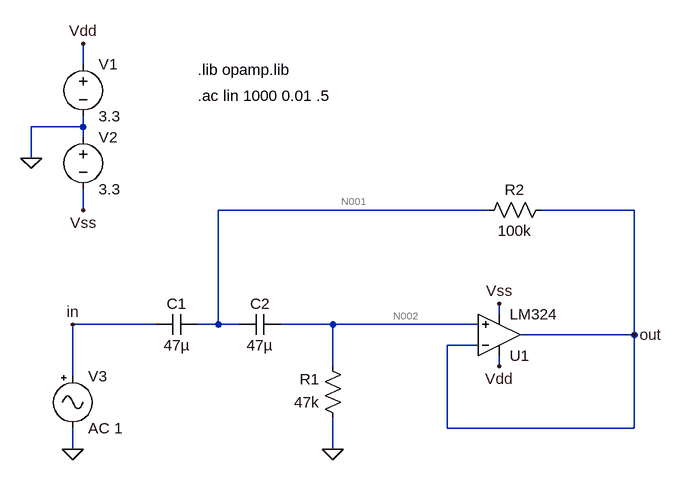
[diagram p0: schematic passa_altas_vcvs_2_ordem.asc]
passa_altas_vcvs_2_ordem.asc, the LTspice schematic file:
Version 4
SHEET 1 880 680
WIRE -352 -240 -352 -272
WIRE -352 -144 -352 -160
WIRE -352 -144 -432 -144
WIRE -352 -128 -352 -144
WIRE -432 -96 -432 -144
WIRE -352 -16 -352 -48
WIRE 272 -16 -144 -16
WIRE 496 -16 352 -16
WIRE 288 144 288 128
WIRE -240 160 -368 160
WIRE -144 160 -144 -16
WIRE -144 160 -176 160
WIRE -112 160 -144 160
WIRE 32 160 -48 160
WIRE 256 160 32 160
WIRE 496 176 496 -16
WIRE 496 176 320 176
WIRE 256 192 208 192
WIRE 32 224 32 160
WIRE 288 224 288 208
WIRE -368 240 -368 160
WIRE 208 320 208 192
WIRE 496 320 496 176
WIRE 496 320 208 320
WIRE -368 352 -368 320
WIRE 32 352 32 304
FLAG 32 352 0
FLAG -432 -96 0
FLAG -352 -272 Vdd
FLAG 288 224 Vdd
FLAG 288 128 Vss
FLAG -352 -16 Vss
FLAG -368 352 0
FLAG -368 160 in
FLAG 496 176 out
SYMBOL res 48 320 R180
WINDOW 0 36 76 Left 2
WINDOW 3 36 40 Left 2
SYMATTR InstName R1
SYMATTR Value 47k
SYMBOL res 256 0 R270
WINDOW 0 32 56 VTop 2
WINDOW 3 0 56 VBottom 2
SYMATTR InstName R2
SYMATTR Value 100k
SYMBOL cap -176 144 R90
WINDOW 0 0 32 VBottom 2
WINDOW 3 32 32 VTop 2
SYMATTR InstName C1
SYMATTR Value 47µ
SYMBOL cap -48 144 R90
WINDOW 0 0 32 VBottom 2
WINDOW 3 32 32 VTop 2
SYMATTR InstName C2
SYMATTR Value 47µ
SYMBOL voltage -352 -256 R0
SYMATTR InstName V1
SYMATTR Value 3.3
SYMBOL voltage -352 -144 R0
SYMATTR InstName V2
SYMATTR Value 3.3
SYMBOL Misc\\signal -368 224 R0
WINDOW 123 0 0 Left 2
WINDOW 39 0 0 Left 2
SYMATTR InstName V3
SYMATTR Value AC 1
SYMBOL Opamps\\opamp2 288 240 M180
SYMATTR InstName U1
SYMATTR Value LM324
TEXT -176 -192 Left 2 !.ac lin 1000 0.01 .5
TEXT -176 -232 Left 2 !.lib opamp.lib

The netlist it stands for:
* passa_altas_vcvs_2_ordem.asc
R1 0 N002 47k
R2 N001 out 100k
C1 N001 in 47µ
C2 N002 N001 47µ
V1 Vdd 0 3.3
V2 0 Vss 3.3
V3 in 0 AC 1
XU1 N002 out Vdd Vss out LM324  ; pins In+ In- V+ V- OUT
.ac lin 1000 0.01 .5
.lib opamp.lib
.backanno
.end

* Results of the author's LTspice run, read from the files saved beside the schematic
* Operating Point, zero values left out:
*   V(n002) = 2.103 mV
*   V(n001) = 1.91 mV
*   V(out) = 1.91 mV
*   V(vdd) = 3.3 V
*   V(vss) = -3.3 V
*   I(R1) = -44.74 nA
*   I(V2) = -742 µA
*   I(V1) = -742.1 µA
*   Ix(u1:1) = -44.74 nA
*   Ix(u1:2) = -44.96 nA
*   Ix(u1:3) = 742.1 µA
*   Ix(u1:4) = -742 µA
*   Ix(u1:5) = 44.96 nA
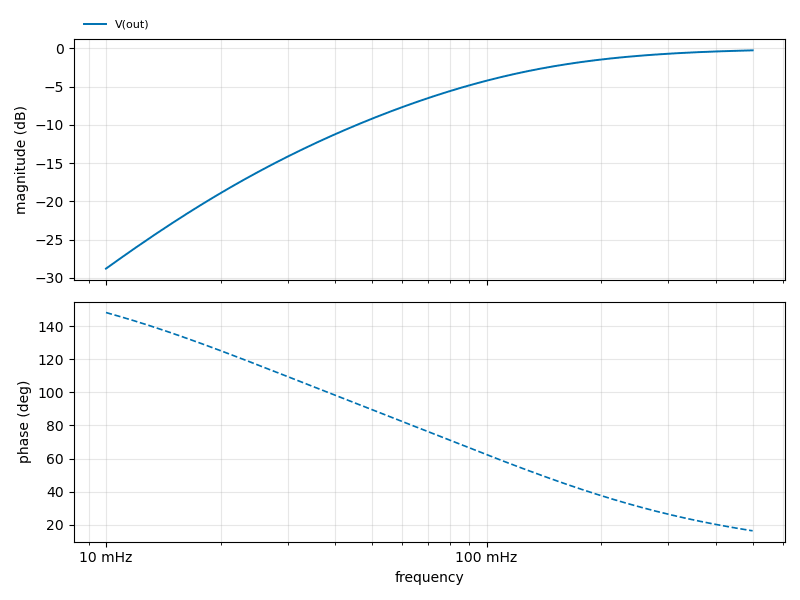
[diagram p1: AC Analysis of passa_altas_vcvs_2_ordem.asc, plotted from the saved traces]
* AC Analysis, 1 run:
*   V(out): -28.78 dB at 10 mHz, -0.27 dB at 500 mHz, peak -0.27 dB at 500 mHz, 3 dB below the peak at 120.2 mHz